# Altium project PADS PROJEKT Wzmacniacza gitarowego.PrjPcb
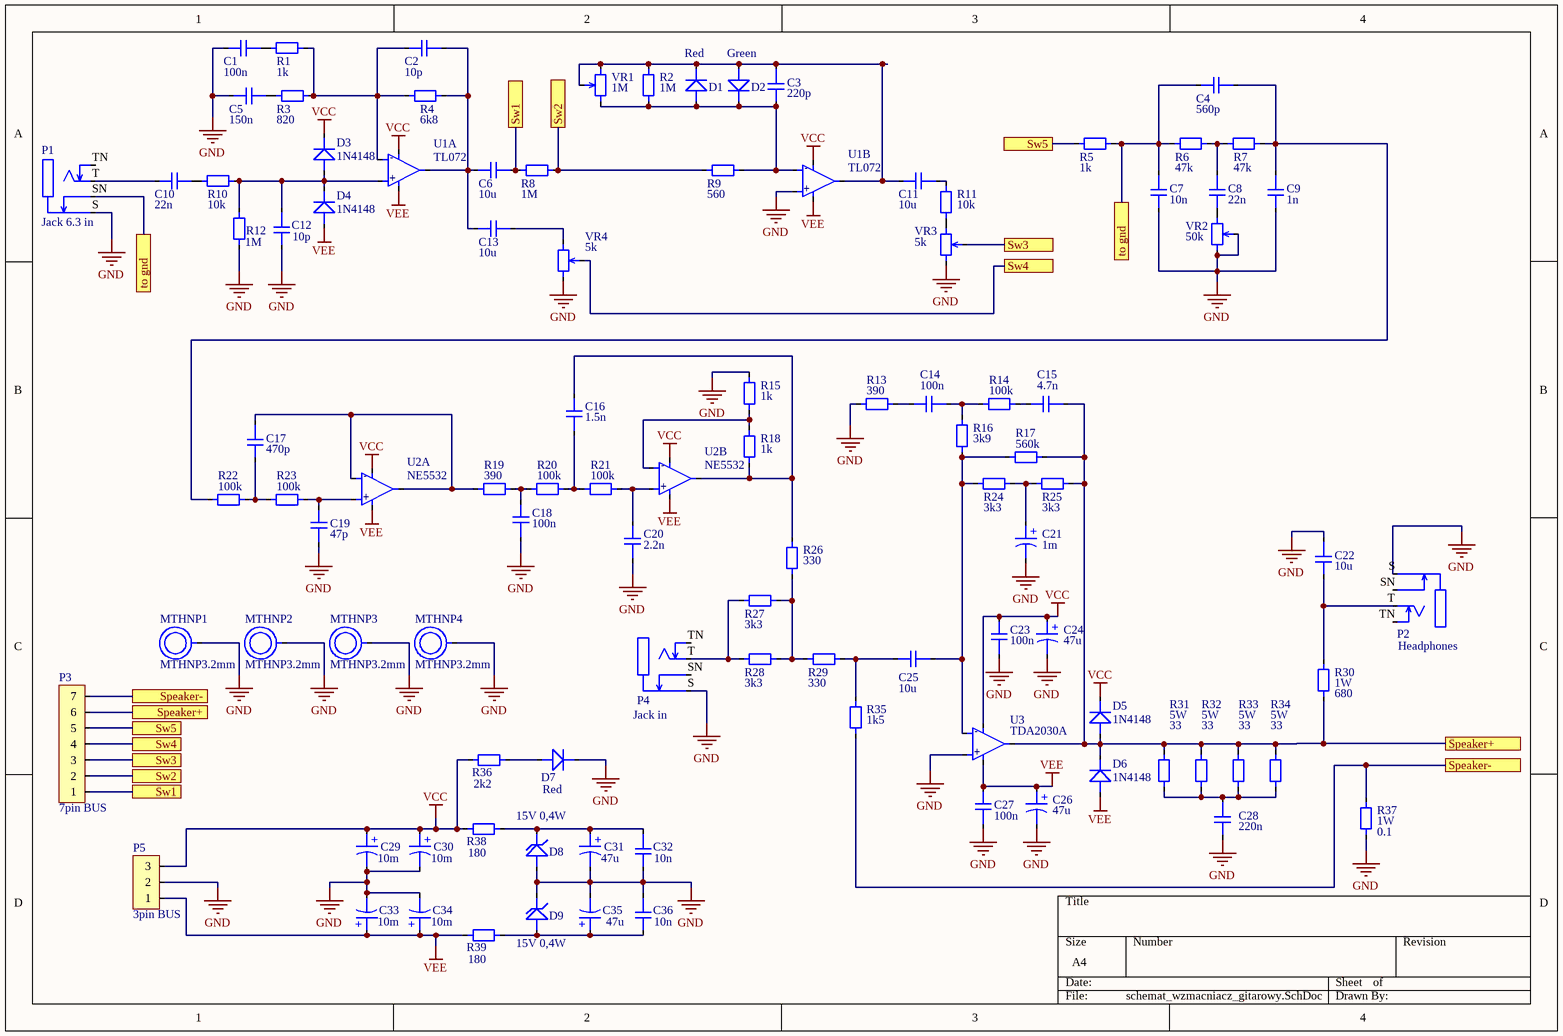
[diagram p0: schemat_wzmacniacz_gitarowy.SchDoc]
1 sheet, 100 parts. Net scope: flat (ports and power ports of the same name join across sheets).
Board file: PCB_wzmacniacz.PcbDoc

## Sheet schemat_wzmacniacz_gitarowy.SchDoc
size A4; SheetNumber: 1; SheetTotal: 1

### Parts
C1  Capacitance: 100n  [Capacitor THT 2,54mm - duplicate]  (hidden comment: CAP ceramic 2,5mm generic)
C2  Capacitance: 10p  [Capacitor THT 2,54mm - duplicate]  (hidden comment: CAP ceramic 2,5mm generic)
C3  Capacitance: 220p  [Capacitor THT 2,54mm - duplicate]  (hidden comment: CAP ceramic 2,5mm generic)
C4  Capacitance: 560p  [Capacitor THT 2,54mm - duplicate]  (hidden comment: CAP ceramic 2,5mm generic)
C5  Capacitance: 150n  [Capacitor THT 5mm]  (hidden comment: CAP ceramic 5mm generic_1)
C6  Capacitance: 10u  [Capacitor THT 2,54mm - duplicate]  (hidden comment: CAP ceramic 2,5mm generic)
C7  Capacitance: 10n  [Capacitor THT 2,54mm - duplicate]  (hidden comment: CAP ceramic 2,5mm generic)
C8  Capacitance: 22n  [Capacitor THT 2,54mm - duplicate]  (hidden comment: CAP ceramic 2,5mm generic)
C9  Capacitance: 1n  [Capacitor THT 2,54mm - duplicate]  (hidden comment: CAP ceramic 2,5mm generic)
C10  Capacitance: 22n  [Capacitor THT 2,54mm - duplicate]  (hidden comment: CAP ceramic 2,5mm generic)
C11  Capacitance: 10u  [Capacitor THT 2,54mm - duplicate]  (hidden comment: CAP ceramic 2,5mm generic)
C12  Capacitance: 10p  [Capacitor THT 2,54mm - duplicate]  (hidden comment: CAP ceramic 2,5mm generic)
C13  Capacitance: 10u  [Capacitor THT 2,54mm - duplicate]  (hidden comment: CAP ceramic 2,5mm generic)
C14  Capacitance: 100n  [Capacitor THT 2,54mm - duplicate]  (hidden comment: CAP ceramic 2,5mm generic)
C15  Capacitance: 4.7n  [Capacitor THT 2,54mm - duplicate]  (hidden comment: CAP ceramic 2,5mm generic)
C16  Capacitance: 1.5n  [Capacitor THT 2,54mm - duplicate]  (hidden comment: CAP ceramic 2,5mm generic)
C17  Capacitance: 470p  [Capacitor THT 2,54mm - duplicate]  (hidden comment: CAP ceramic 2,5mm generic)
C18  Capacitance: 100n  [Capacitor THT 2,54mm - duplicate]  (hidden comment: CAP ceramic 2,5mm generic)
C19  Capacitance: 47p  [Capacitor THT 2,54mm - duplicate]  (hidden comment: CAP ceramic 2,5mm generic)
C20  Capacitance: 2.2n  [Capacitor THT 2,54mm - duplicate]  (hidden comment: CAP ceramic 2,5mm generic)
C21  Capacitance: 1m  [Capacitor Electrolytic THT fi13]  (hidden comment: Cap electrolytic fi13 generic)
C22  Capacitance: 10u  [Capacitor THT 2,54mm - duplicate]  (hidden comment: CAP ceramic 2,5mm generic)
C23  Capacitance: 100n  [Capacitor THT 2,54mm - duplicate]  (hidden comment: CAP ceramic 2,5mm generic)
C24  Capacitance: 47u  [Capacitor electrolytic tht fi8]  (hidden comment: Cap electrolytic fi8 generic)
C25  Capacitance: 10u  [Capacitor THT 2,54mm - duplicate]  (hidden comment: CAP ceramic 2,5mm generic)
C26  Capacitance: 47u  [Capacitor electrolytic tht fi8]  (hidden comment: Cap electrolytic fi8 generic)
C27  Capacitance: 100n  [Capacitor THT 2,54mm - duplicate]  (hidden comment: CAP ceramic 2,5mm generic)
C28  Capacitance: 220n  [Capacitor THT 5mm]  (hidden comment: CAP ceramic 5mm generic_1)
C29  Capacitance: 10m  [Capacitor electrolytic tht fi16x40]  (hidden comment: Cap electrolytic fi16 generic_1)
C30  Capacitance: 10m  [Capacitor electrolytic tht fi16x40]  (hidden comment: Cap electrolytic fi16 generic_1)
C31  Capacitance: 47u  [Capacitor electrolytic tht fi8]  (hidden comment: Cap electrolytic fi8 generic)
C32  Capacitance: 10n  [Capacitor THT 2,54mm - duplicate]  (hidden comment: CAP ceramic 2,5mm generic)
C33  Capacitance: 10m  [Capacitor electrolytic tht fi16x40]  (hidden comment: Cap electrolytic fi16 generic_1)
C34  Capacitance: 10m  [Capacitor electrolytic tht fi16x40]  (hidden comment: Cap electrolytic fi16 generic_1)
C35  Capacitance: 47u  [Capacitor electrolytic tht fi8]  (hidden comment: Cap electrolytic fi8 generic)
C36  Capacitance: 10n  [Capacitor THT 2,54mm - duplicate]  (hidden comment: CAP ceramic 2,5mm generic)
D1  Red  [Led Diode 5mm tht - duplicate]
D2  Green  [Led Diode 5mm tht - duplicate]
D3  1N4148  [1N4148]
D4  1N4148  [1N4148]
D5  1N4148  [1N4148]
D6  1N4148  [1N4148]
D7  Red  [Led Diode 5mm tht - duplicate]
D8  15V 0,4W  [ZENER 15V 0.4W]
D9  15V 0,4W  [ZENER 15V 0.4W]
MTHNP1  MTHNP3.2mm  [MTH NP 3.2mm]
MTHNP2  MTHNP3.2mm  [MTH NP 3.2mm]
MTHNP3  MTHNP3.2mm  [MTH NP 3.2mm]
MTHNP4  MTHNP3.2mm  [MTH NP 3.2mm]
P1  Jack 6.3 in  [AMPHENOL ACJM-HHOP]
P2  Headphones  [AMPHENOL ACJM-HHOP]
P3  7pin BUS  [7 PIN BUS]
P4  Jack in  [AMPHENOL ACJM-HHOP]
P5  3pin BUS  [3 Pin BUS]
R1  Resistance: 1k  [Resistor THT 0,25W]  (hidden comment: Resistor 1/4W generic)
R2  Resistance: 1M  [Resistor THT 0,25W]  (hidden comment: Resistor 1/4W generic)
R3  Resistance: 820  [Resistor THT 0,25W]  (hidden comment: Resistor 1/4W generic)
R4  Resistance: 6k8  [Resistor THT 0,25W]  (hidden comment: Resistor 1/4W generic)
R5  Resistance: 1k  [Resistor THT 0,25W]  (hidden comment: Resistor 1/4W generic)
R6  Resistance: 47k  [Resistor THT 0,25W]  (hidden comment: Resistor 1/4W generic)
R7  Resistance: 47k  [Resistor THT 0,25W]  (hidden comment: Resistor 1/4W generic)
R8  Resistance: 1M  [Resistor THT 0,25W]  (hidden comment: Resistor 1/4W generic)
R9  Resistance: 560  [Resistor THT 0,25W]  (hidden comment: Resistor 1/4W generic)
R10  Resistance: 10k  [Resistor THT 0,25W]  (hidden comment: Resistor 1/4W generic)
R11  Resistance: 10k  [Resistor THT 0,25W]  (hidden comment: Resistor 1/4W generic)
R12  Resistance: 1M  [Resistor THT 0,25W]  (hidden comment: Resistor 1/4W generic)
R13  Resistance: 390  [Resistor THT 0,25W]  (hidden comment: Resistor 1/4W generic)
R14  Resistance: 100k  [Resistor THT 0,25W]  (hidden comment: Resistor 1/4W generic)
R15  Resistance: 1k  [Resistor THT 0,25W]  (hidden comment: Resistor 1/4W generic)
R16  Resistance: 3k9  [Resistor THT 0,25W]  (hidden comment: Resistor 1/4W generic)
R17  Resistance: 560k  [Resistor THT 0,25W]  (hidden comment: Resistor 1/4W generic)
R18  Resistance: 1k  [Resistor THT 0,25W]  (hidden comment: Resistor 1/4W generic)
R19  Resistance: 390  [Resistor THT 0,25W]  (hidden comment: Resistor 1/4W generic)
R20  Resistance: 100k  [Resistor THT 0,25W]  (hidden comment: Resistor 1/4W generic)
R21  Resistance: 100k  [Resistor THT 0,25W]  (hidden comment: Resistor 1/4W generic)
R22  Resistance: 100k  [Resistor THT 0,25W]  (hidden comment: Resistor 1/4W generic)
R23  Resistance: 100k  [Resistor THT 0,25W]  (hidden comment: Resistor 1/4W generic)
R24  Resistance: 3k3  [Resistor THT 0,25W]  (hidden comment: Resistor 1/4W generic)
R25  Resistance: 3k3  [Resistor THT 0,25W]  (hidden comment: Resistor 1/4W generic)
R26  Resistance: 330  [Resistor THT 0,25W]  (hidden comment: Resistor 1/4W generic)
R27  Resistance: 3k3  [Resistor THT 0,25W]  (hidden comment: Resistor 1/4W generic)
R28  Resistance: 3k3  [Resistor THT 0,25W]  (hidden comment: Resistor 1/4W generic)
R29  Resistance: 330  [Resistor THT 0,25W]  (hidden comment: Resistor 1/4W generic)
R30  1W  Resistance: 680  [Resistor THT 1W]
R31  5W  Resistance: 33  [Resistor THT 5W]
R32  5W  Resistanceter 1: 33  [Resistor THT 5W]
R33  5W  Resistanceter 1: 33  [Resistor THT 5W]
R34  5W  Resistanceter 1: 33  [Resistor THT 5W]
R35  Resistance: 1k5  [Resistor THT 0,25W]  (hidden comment: Resistor 1/4W generic)
R36  Resistance: 2k2  [Resistor THT 0,25W]  (hidden comment: Resistor 1/4W generic)
R37  1W  Resistance: 0.1  [Resistor THT 1W]
R38  Resistance: 180  [Resistor THT 0,25W]  (hidden comment: Resistor 1/4W generic)
R39  Resistance: 180  [Resistor THT 0,25W]  (hidden comment: Resistor 1/4W generic)
U1  TL072  [DIP8]  (parts A,B of 2)
U2  NE5532  [DIP8]  (parts A,B of 2)
U3  TDA2030A  [TDA2030A]
VR1  Resistance: 1M  [Variable Resistor]  (hidden comment: VR generic)
VR2  Resistance: 50k  [Variable Resistor]  (hidden comment: VR generic)
VR3  Resistance: 5k  [Variable Resistor]  (hidden comment: VR generic)
VR4  Resistance: 5k  [Variable Resistor]  (hidden comment: VR generic)

### Ports
Speaker+ (see schemat_wzmacniacz_gitarowy[1C]), Speaker+ (see schemat_wzmacniacz_gitarowy[4C]), Speaker- (see schemat_wzmacniacz_gitarowy[1C]), Speaker- (see schemat_wzmacniacz_gitarowy[4C]), Sw1 (see schemat_wzmacniacz_gitarowy[1D]), Sw1 (see schemat_wzmacniacz_gitarowy[2A]), Sw2 (see schemat_wzmacniacz_gitarowy[1D]), Sw2 (see schemat_wzmacniacz_gitarowy[2A]), Sw3 (see schemat_wzmacniacz_gitarowy[1C]), Sw3 (see schemat_wzmacniacz_gitarowy[3A]), Sw4 (see schemat_wzmacniacz_gitarowy[1C]), Sw4 (see schemat_wzmacniacz_gitarowy[3B]), Sw5 (see schemat_wzmacniacz_gitarowy[1C]), Sw5 (see schemat_wzmacniacz_gitarowy[3A]), to gnd (see schemat_wzmacniacz_gitarowy[1B]), to gnd (see schemat_wzmacniacz_gitarowy[3A])

### Nets
GND: C1.1 C5.1 C7.1 C9.1 C12.1 C18.2 C19.2 C20.2 C21.2 C22.2 C23.2 C24.2 C26.2 C27.2 C28.1 C29.2 C30.2 C31.2 C32.1 C33.2 C34.2 C35.2 C36.2 D7.K D8.A D9.K MTHNP1.1 MTHNP2.1 MTHNP3.1 MTHNP4.1 P1.S P2.S P4.S P5.2 R12.1 R13.1 R15.2 R37.2 U1.5(2IN+) U3.1(IN+) VR2.1 VR2.2 VR3.1 VR4.1
VCC: C23.1 C24.1 C29.1 C30.1 D3.K D5.K P5.3 R36.1 R38.1 U1.8(VCC) U2.8(VCC) U3.5(VCC)
VEE: C26.1 C27.1 C33.1 C34.1 D4.A D6.A P5.1 R39.1 U1.4(VEE) U2.4(VEE) U3.3(VEE)
NetC1_2: C1.2 R1.1
NetC2_1: C2.1 R1.2 R3.2 R4.1 U1.2(1IN-)
NetC2_2: C2.2 C6.1 C13.1 R4.2 U1.1(1OUT)
NetC3_1: C3.1 D1.A D2.K R2.1 R9.2 U1.6(2IN-) VR1.3
NetC3_2: C3.2 C11.1 D1.K D2.A R2.2 U1.7(2OUT) VR1.1 VR1.2
NetC4_1: C4.1 C7.2 P1.SN R5.2 R6.1 ; port to gnd
NetC4_2: C4.2 C9.2 R7.2 R22.1
NetC5_2: C5.2 R3.1
NetC6_2: C6.2 P3.1 R8.1 ; port Sw1
NetC8_1: C8.1 VR2.3
NetC8_2: C8.2 R6.2 R7.1
NetC10_1: C10.1 P1.T
NetC10_2: C10.2 R10.1
NetC11_2: C11.2 R11.2
NetC12_2: C12.2 D3.A D4.K R10.2 R12.2 U1.3(1IN+)
NetC13_2: C13.2 VR4.3
NetC14_1: C14.1 R13.2
NetC14_2: C14.2 R14.1 R16.2
NetC15_1: C15.1 R14.2
NetC15_2: C15.2 D5.A D6.K P3.6 R17.1 R25.1 R30.2 R31.1 R32.1 R33.1 R34.1 U3.4(OUT) ; port Speaker+
NetC16_1: C16.1 R18.1 R26.1 U2.7(2OUT)
NetC16_2: C16.2 R20.2 R21.1
NetC17_1: C17.1 R22.2 R23.1
NetC17_2: C17.2 R19.1 U2.1(1OUT) U2.2(1IN-)
NetC18_1: C18.1 R19.2 R20.1
NetC19_1: C19.1 R23.2 U2.3(1IN+)
NetC20_1: C20.1 R21.2 U2.5(2IN+)
NetC21_1: C21.1 R24.1 R25.2
NetC22_1: C22.1 P2.T R30.1
NetC25_1: C25.1 R29.2 R35.2
NetC25_2: C25.2 R16.1 R17.2 R24.2 U3.2(IN-)
NetC28_2: C28.2 R31.2 R32.2 R33.2 R34.2
NetC31_1: C31.1 C32.2 D8.K R38.2
NetC35_1: C35.1 C36.1 D9.A R39.2
NetD7_A: D7.A R36.2
NetP3_2: P3.2 R8.2 R9.1 ; port Sw2
NetP3_3: P3.3 VR3.2 ; port Sw3
NetP3_4: P3.4 VR4.2 ; port Sw4
NetP3_5: P3.5 R5.1 ; port Sw5
NetP3_7: P3.7 R35.1 R37.1 ; port Speaker-
NetP4_T: P4.T R27.2 R28.1
NetR11_1: R11.1 VR3.3
NetR15_1: R15.1 R18.2 U2.6(2IN-)
NetR26_2: R26.2 R27.1 R28.2 R29.1

Not connected (* = marked no-connect by the designer): P1 TN; P2 SN TN; P4 SN TN

### Notes on the sheet
- (in symbol Cap electrolytic fi8 generic) +
- (in symbol Cap electrolytic fi13 generic) +
- (in symbol Cap electrolytic fi16 generic_1) +
- (in symbol NE5532, part A) -; +
- (in symbol NE5532, part B) -; +
- (in symbol TDA2030A) -; +
- (in symbol TL072, part A) -; +
- (in symbol TL072, part B) -; +

### Library data of the parts
D1 D2 D7 = LED Diode
D8 D9 = Zner 15V 0,4W
MTHNP1-MTHNP4 = MTH NP 3.2mm: Mounting hole non plated 3.2mm
P1 P2 P4 = AMPHENOL ACJM-HHOP
P3 = 7pin BUS: raster 5mm
P5 = 3pin BUS: raster 5mm
R30 R37 = Resistor 1W generic: Power Rating: 1W
R31-R34 = Resistor 5W generic: Power Rating: 5W
C1-C4 C6-C20 C22 C23 C25 C27 C32 C36 = CAP ceramic 2,5mm generic: Voltage rating: *
C5 C28 = CAP ceramic 5mm generic_1: Voltage rating: *
C21 = Cap electrolytic fi13 generic: Voltage rating: *
C24 C26 C31 C35 = Cap electrolytic fi8 generic: Voltage rating: *
C29 C30 C33 C34 = Cap electrolytic fi16 generic_1: Voltage rating: *